# Altium project plp-ctop_2b.PrjPcb
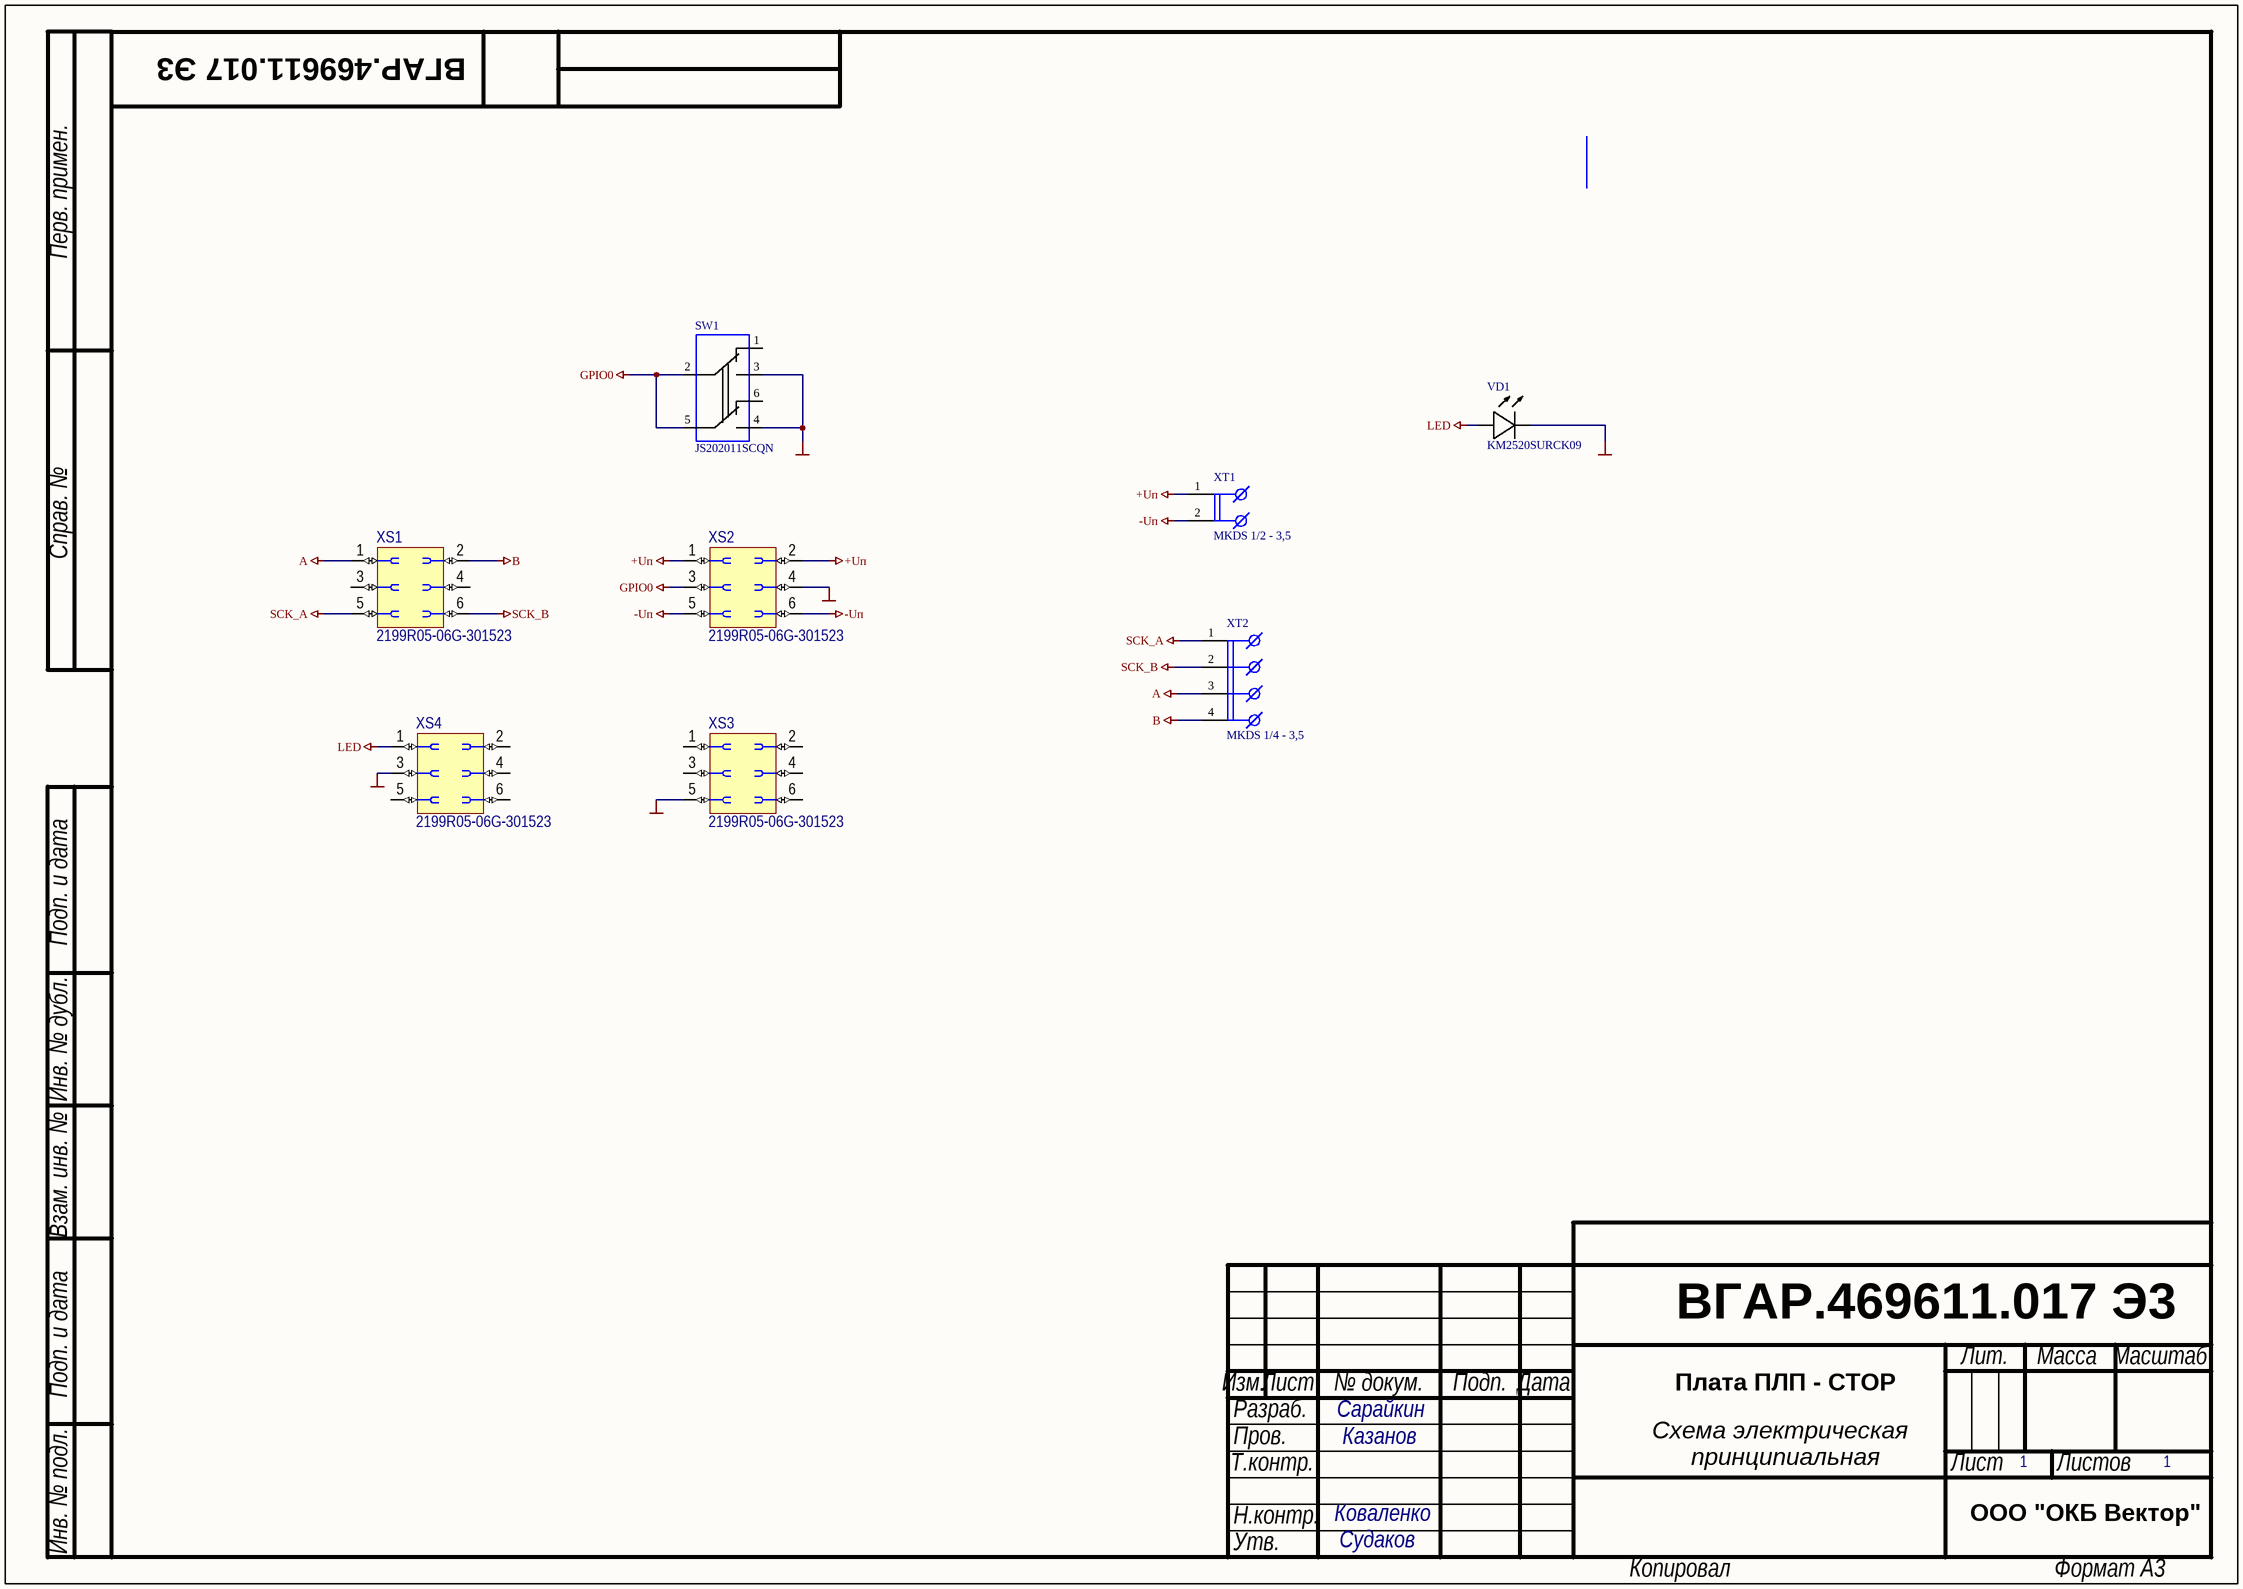
[diagram p0: plp-ctop_2a.SchDoc]
1 sheet, 8 parts. Net scope: global (net labels, ports and power ports of the same name join across sheets).
Board file: plp-ctop_2b.PcbDoc

## Sheet plp-ctop_2a.SchDoc
size 420 x 297 mm; PageSetup: Record=PageOptions|CenterHorizontal=False|CenterVertical=False|PrintScale=0.96|XCorrection=0.00|YCorrection=0.00|PrintKind=1|BorderSize=5000000|LeftOffset=0|BottomOffset=0|Orientation=2|PaperLength=4200|PaperWidth=2970|Scale=100|PaperSource=7|PrintQuality=600|MediaType=1|DitherType=10|PaperKind=A3|PrintScaleMode=1; Rule: PcbType=ProtelPcb

### Parts
SW1  JS202011SCQN  [JS202011SCQN]
VD1  KM2520SURCK09  [KM2520SURCK09]
XS1  2199R05-06G-301523  [CON: PLL-6(2x3R1.27female)]
XS2  2199R05-06G-301523  [CON: PLL-6(2x3R1.27female)]
XS3  2199R05-06G-301523  [CON: PLL-6(2x3R1.27female)]
XS4  2199R05-06G-301523  [CON: PLL-6(2x3R1.27female)]
XT1  MKDS 1/2 - 3,5  [MKDS 1/2 - 3,5]
XT2  MKDS 1/4 - 3,5  [MKDS 1/4 - 3,5]

### Nets
+Uп: XS2.1 XS2.2 XT1.1
-Uп: XS2.5 XS2.6 XT1.2
A: XS1.1 XT2.3
B: XS1.2 XT2.4
GND: SW1.3 SW1.4 VD1.2(K) XS2.4 XS3.5 XS4.3
GPIO0: SW1.2 SW1.5 XS2.3
LED: VD1.1(A) XS4.1
SCK_A: XS1.5 XT2.1
SCK_B: XS1.6 XT2.2

Not connected (* = marked no-connect by the designer): SW1 1 6; XS1 3 4; XS3 1 2 3 4 6; XS4 2 4 5 6

### Notes on the sheet
- ВГАР.469611.017 Э3
- Плата ПЛП - CTOP
- Сарайкин
- Казанов
- Схема электрическая
- принципиальная
- 1
- Коваленко
- ООО "ОКБ Вектор"
- Судаков
- Перв. примен.
- Справ. №
- Подп. и дата
- Инв. № дубл.
- Взам. инв. №
- Изм.
- Лист
- № докум.
- Подп.
- Дата
- Лит.
- Масса
- Масштаб
- Т.контр.
- Пров.
- Разраб.
- Листов
- Инв. № подл.
- Н.контр.
- Утв.
- Копировал
- Формат А3

### Library data of the parts
SW1 = JS202011SCQN: Переключатель; Manufacturer: C&K Component; ReplacementPart1Manufacturer: Китай; ReplacementPart1PartNumber: is-1390; ComponentLink1Description: Data Sheet; ComponentLink1URL: http://www.tycoelectronics.com/catalog/pn/en/1571983-4?RQPN=1571983-4; ComponentLink2Description: Replacement 1 DataSheet
VD1 = KM2520SURCK09: LED
XS1-XS4 = 2199R05-06G-301523In: Step 1.27
XT2 = MKDS 1/4 - 3,5: ComponentLink1Description: Datasheet; ComponentLink1URL: https://www.phoenixcontact.com/online/portal/ru?uri=pxc-oc-itemdetail:pid=1751248&library=ruru&tab=1